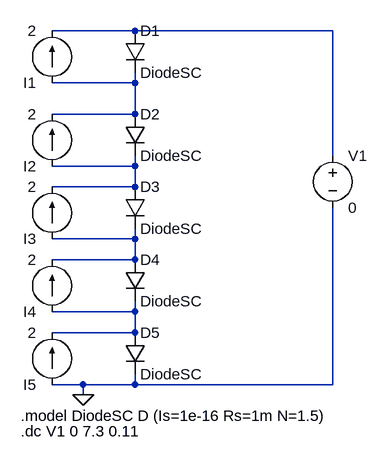
[diagram p0: schematic 5.asc]
5.asc, the LTspice schematic file:
Version 4
SHEET 1 880 760
WIRE 96 128 -32 128
WIRE 400 128 96 128
WIRE 96 208 96 192
WIRE 96 208 -32 208
WIRE 96 256 96 208
WIRE 96 256 -32 256
WIRE 400 320 400 128
WIRE 96 336 96 320
WIRE 96 336 -32 336
WIRE 96 368 96 336
WIRE 96 368 -32 368
WIRE 96 384 96 368
WIRE 96 448 96 432
WIRE 96 448 -32 448
WIRE 96 480 96 448
WIRE 96 480 -32 480
WIRE 96 560 96 544
WIRE 96 560 -32 560
WIRE 96 592 96 560
WIRE 96 592 -32 592
WIRE 16 672 -32 672
WIRE 96 672 96 656
WIRE 96 672 16 672
WIRE 400 672 400 400
WIRE 400 672 96 672
WIRE 16 688 16 672
FLAG 16 688 0
SYMBOL diode 80 128 R0
SYMATTR InstName D1
SYMATTR Value DiodeSC
SYMBOL current -32 208 R180
WINDOW 123 0 0 Left 0
WINDOW 39 0 0 Left 0
SYMATTR InstName I1
SYMATTR Value 2
SYMBOL diode 80 256 R0
SYMATTR InstName D2
SYMATTR Value DiodeSC
SYMBOL current -32 336 R180
WINDOW 123 0 0 Left 0
WINDOW 39 0 0 Left 0
SYMATTR InstName I2
SYMATTR Value 2
SYMBOL diode 80 368 R0
SYMATTR InstName D3
SYMATTR Value DiodeSC
SYMBOL current -32 448 R180
WINDOW 123 0 0 Left 0
WINDOW 39 0 0 Left 0
SYMATTR InstName I3
SYMATTR Value 2
SYMBOL diode 80 480 R0
SYMATTR InstName D4
SYMATTR Value DiodeSC
SYMBOL current -32 560 R180
WINDOW 123 0 0 Left 0
WINDOW 39 0 0 Left 0
SYMATTR InstName I4
SYMATTR Value 2
SYMBOL diode 80 592 R0
SYMATTR InstName D5
SYMATTR Value DiodeSC
SYMBOL current -32 672 R180
WINDOW 123 0 0 Left 0
WINDOW 39 0 0 Left 0
SYMATTR InstName I5
SYMATTR Value 2
SYMBOL voltage 400 304 R0
WINDOW 123 0 0 Left 0
WINDOW 39 0 0 Left 0
SYMATTR InstName V1
SYMATTR Value 0
TEXT -80 744 Left 2 !.dc V1 0 7.3 0.11
TEXT -80 720 Left 2 !.model DiodeSC D (Is=1e-16 Rs=1m N=1.5)

The netlist it stands for:
* 5.asc
D1 N001 N002 DiodeSC
I1 N002 N001 2
D2 N002 N003 DiodeSC
I2 N003 N002 2
D3 N003 N004 DiodeSC
I3 N004 N003 2
D4 N004 N005 DiodeSC
I4 N005 N004 2
D5 N005 0 DiodeSC
I5 0 N005 2
V1 N001 0 0
.model D D
.lib standard.dio
.dc V1 0 7.3 0.11
.model DiodeSC D (Is=1e-16 Rs=1m N=1.5)
.backanno
.end

* Results of the author's LTspice run, read from the files saved beside the schematic
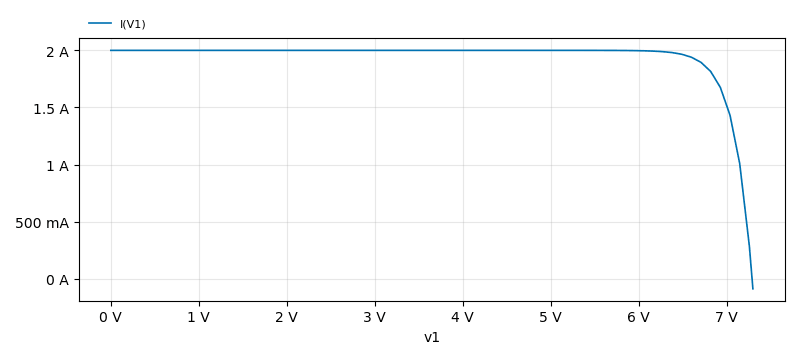
[diagram p1: DC transfer characteristic of 5.asc, plotted from the saved traces]
* DC transfer characteristic, 1 run:
*   I(V1): 2 A at v1=0 V, -87.95 mA at v1=7.3 V, min -87.95 mA, max 2 A